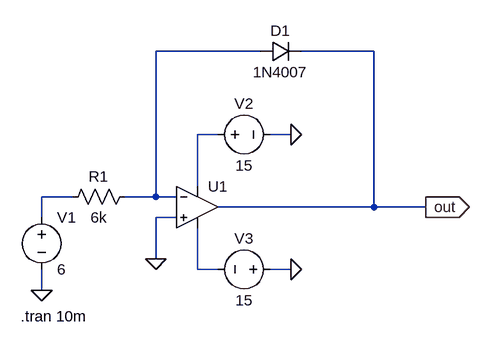
[diagram p0: schematic Day7_Log Ampilifer_OpAmp.asc]
Day7_Log Ampilifer_OpAmp.asc, the LTspice schematic file:
Version 4.1
SHEET 1 880 680
WIRE 288 -64 128 -64
WIRE 464 -64 352 -64
WIRE 224 64 192 64
WIRE 336 64 304 64
WIRE 192 144 192 64
WIRE 0 160 -48 160
WIRE 128 160 128 -64
WIRE 128 160 80 160
WIRE 160 160 128 160
WIRE 464 176 464 -64
WIRE 464 176 224 176
WIRE 544 176 464 176
WIRE -48 192 -48 160
WIRE 160 192 128 192
WIRE 128 256 128 192
WIRE 192 272 192 208
WIRE 224 272 192 272
WIRE 336 272 304 272
WIRE -48 304 -48 272
FLAG -48 304 0
FLAG 128 256 0
FLAG 336 64 0
FLAG 336 272 0
FLAG 544 176 out
IOPIN 544 176 Out
SYMBOL OpAmps\\UniversalOpAmp2 192 176 R0
SYMATTR InstName U1
SYMBOL res 96 144 R90
WINDOW 0 0 56 VBottom 2
WINDOW 3 32 56 VTop 2
SYMATTR InstName R1
SYMATTR Value 6k
SYMBOL voltage -48 176 R0
WINDOW 123 0 0 Left 0
WINDOW 39 0 0 Left 0
SYMATTR InstName V1
SYMATTR Value 6
SYMBOL voltage 208 64 R270
WINDOW 0 32 56 VTop 2
WINDOW 3 -32 56 VBottom 2
WINDOW 123 0 0 Left 0
WINDOW 39 0 0 Left 0
SYMATTR InstName V2
SYMATTR Value 15
SYMBOL voltage 320 272 R90
WINDOW 0 -32 56 VBottom 2
WINDOW 3 32 56 VTop 2
WINDOW 123 0 0 Left 0
WINDOW 39 0 0 Left 0
SYMATTR InstName V3
SYMATTR Value 15
SYMBOL diode 288 -48 R270
WINDOW 0 32 32 VTop 2
WINDOW 3 0 32 VBottom 2
SYMATTR InstName D1
SYMATTR Value 1N4007
TEXT -80 344 Left 2 !.tran 10m

The netlist it stands for:
* Day7_Log Ampilifer_OpAmp.asc
X§U1 0 N001 N002 N004 out level2 Avol=1Meg GBW=10Meg Slew=10Meg Ilimit=25m Rail=0 Vos=0 En=0 Enk=0 In=0 Ink=0 Rin=500Meg  ; pins In+ In- V+ V- OUT
R1 N001 N003 6k
V1 N003 0 6
V2 N002 0 15
V3 0 N004 15
D1 N001 out 1N4007
.model D D
.lib standard.dio
.tran 10m
.lib UniversalOpAmp2.lib
.backanno
.end